# EAGLE schematic lin.reg.schematic (EAGLE 8.3.2)
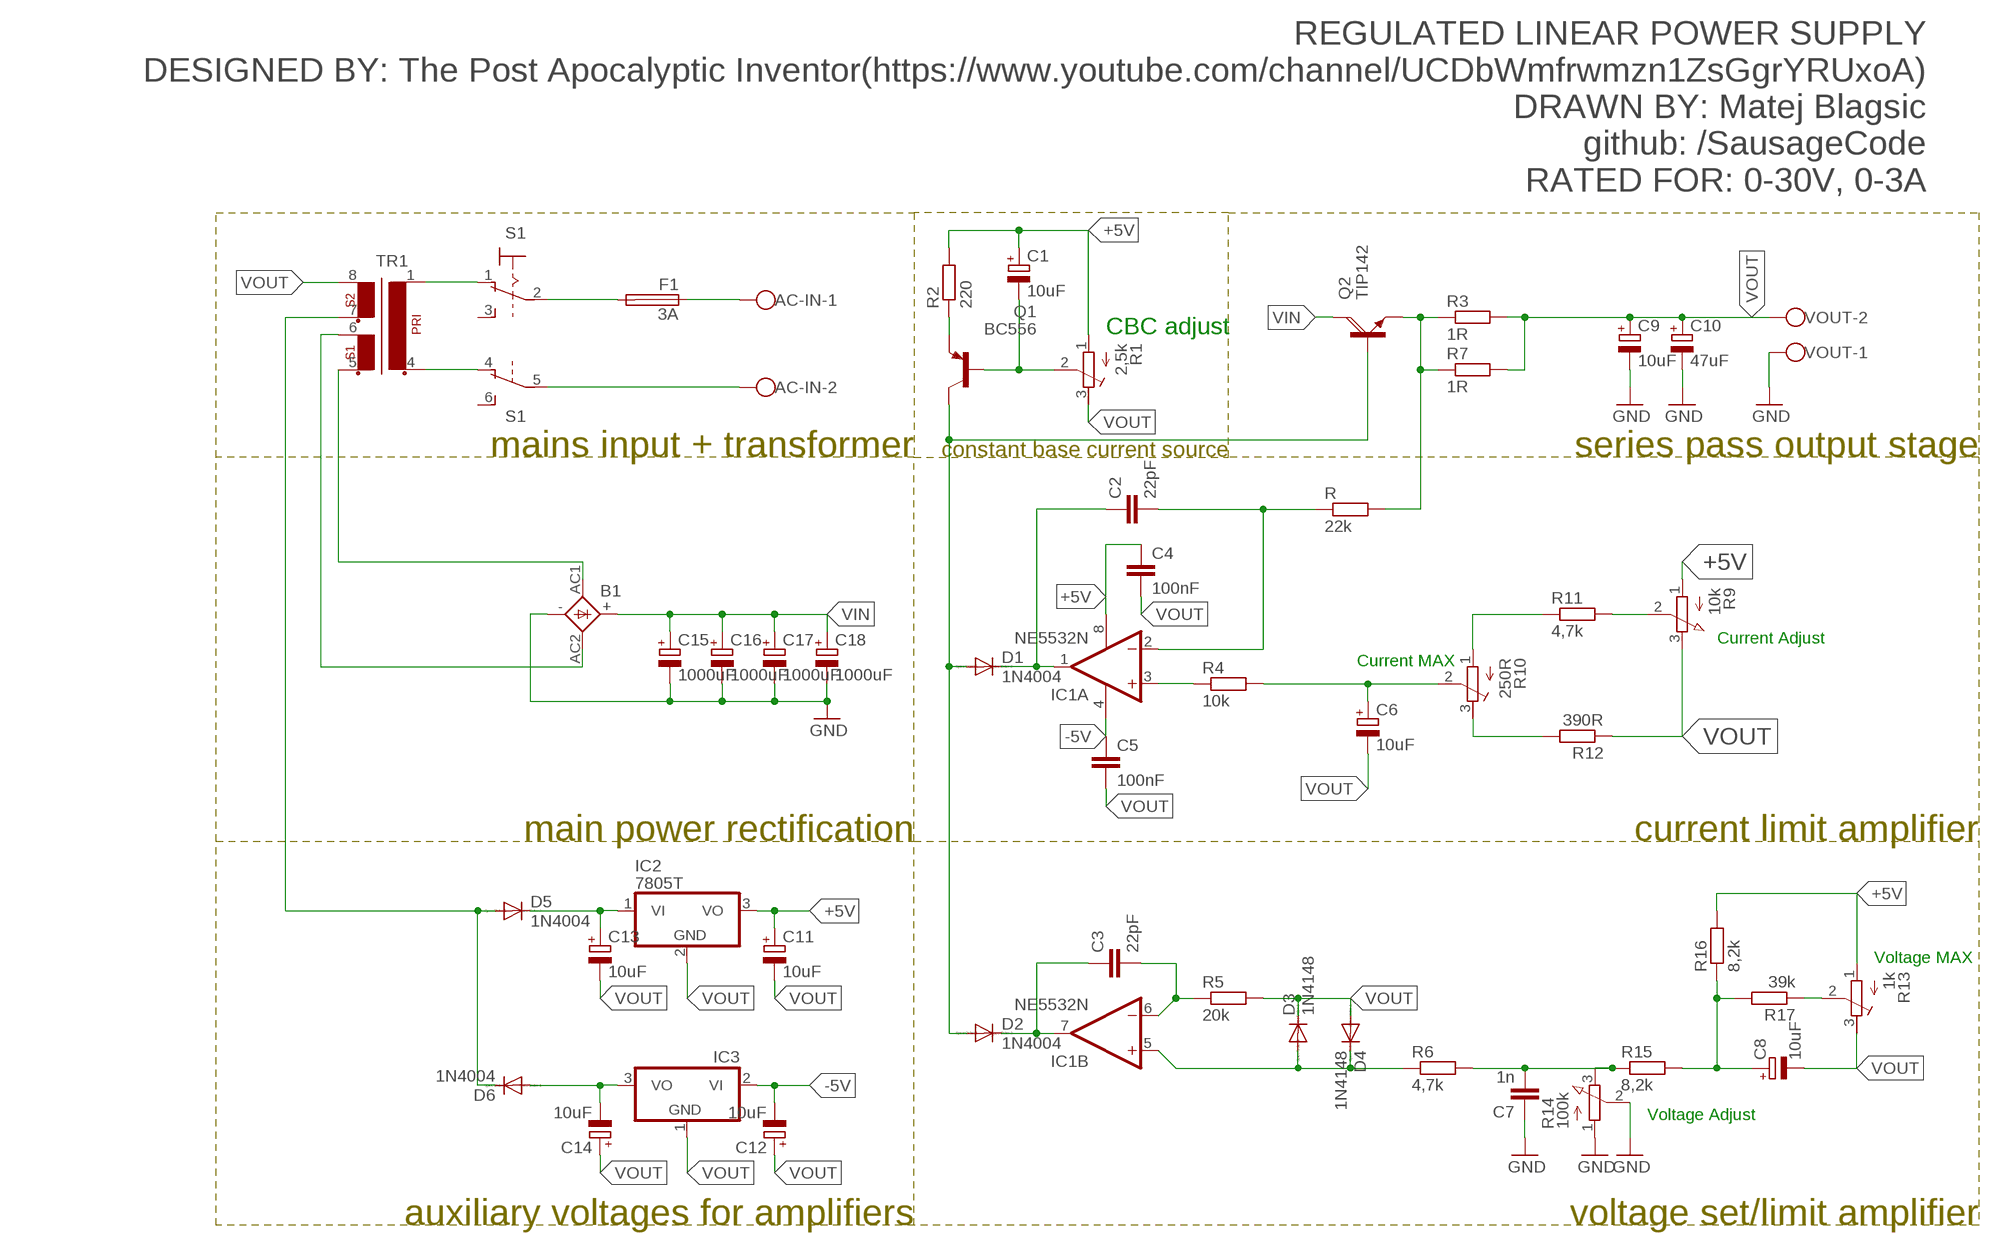
[diagram p0: schematic, sheet 1]

## Parts
AC-IN  W237-102  [W237-102]
B1  2KBB-R  [2KBB-R]
C1  10uF  CPOL-EUE2-5  [E2-5]
C2  22pF  C-EU025-025X050  [C025-025X050]
C3  22pF  C-EU025-025X050  [C025-025X050]
C4  100nF  C-EU025-025X050  [C025-025X050]
C5  100nF  C-EU025-025X050  [C025-025X050]
C6  10uF  CPOL-EUE2-5  [E2-5]
C7  1n  C-EU025-025X050  [C025-025X050]
C8  10uF  CPOL-EUE2-5  [E2-5]
C9  10uF  CPOL-EUE2-5  [E2-5]
C10  47uF  CPOL-EUE2-5  [E2-5]
C11  10uF  CPOL-EUE2-5  [E2-5]
C12  10uF  CPOL-EUE2-5  [E2-5]
C13  10uF  CPOL-EUE2-5  [E2-5]
C14  10uF  CPOL-EUE2-5  [E2-5]
C15  1000uF  CPOL-EUE2-5  [E2-5]
C16  1000uF  CPOL-EUE2-5  [E2-5]
C17  1000uF  CPOL-EUE2-5  [E2-5]
C18  1000uF  CPOL-EUE2-5  [E2-5]
D1  1N4004  [DO41-10]
D2  1N4004  [DO41-10]
D3  1N4148  1N4004  [DO41-10]
D4  1N4148  1N4004  [DO41-10]
D5  1N4004  [DO41-10]
D6  1N4004  [DO41-10]
F1  3A  FUSEGSH15  [GSH15]
IC1  NE5532N  [DIL08]
IC2  7805T  [TO220H]
IC3  7905T  [TO220H]
Q1  BC556  [TO92-EBC]
Q2  TIP142  [SOT93]
R  22k  R-EU_0207/10  [0207/10]
R1  2,5k  R-TRIMM64W  [RTRIM64W]
R2  220  R-EU_0207/10  [0207/10]
R3  1R  R-EU_0207/10  [0207/10]
R4  10k  R-EU_0207/10  [0207/10]
R5  20k  R-EU_0207/10  [0207/10]
R6  4,7k  R-EU_0207/10  [0207/10]
R7  1R  R-EU_0207/10  [0207/10]
R9  10k  3RP/1610N  [3RP/1610N]
R10  250R  R-TRIMM64W  [RTRIM64W]
R11  4,7k  R-EU_0207/10  [0207/10]
R12  390R  R-EU_0207/10  [0207/10]
R13  1k  R-TRIMM64W  [RTRIM64W]
R14  100k  3RP/1610N  [3RP/1610N]
R15  8,2k  R-EU_0207/10  [0207/10]
R16  8,2k  R-EU_0207/10  [0207/10]
R17  39k  R-EU_0207/10  [0207/10]
S1  320-938  [320-938]
TR1  EE20-2  [EE20-2]
VOUT  W237-102  [W237-102]

## Nets
+5V: C1.+ C4.1 C11.+ IC1.8(P:V+) IC2.3(VO) R1.1(A) R2.2 R9.1(A) R13.1(A) R16.2
-5V: C5.1 C12.- IC1.4(P:V-) IC3.2(VI)
GND: B1.- C7.1 C9.- C10.- C15.- C16.- C17.- C18.- R14.1(A) R14.2(S) VOUT.1
N$1: C1.- Q1.B R1.2(S)
N$2: Q1.E R2.1
N$3: R10.1(A) R11.1
N$4: C2.1 D1.C IC1.1(A:OUT)
N$5: C3.1 D2.C IC1.7(B:OUT)
N$6: D1.A D2.A Q1.C Q2.B
N$8: C3.2 IC1.6(B:-IN) R5.1
N$9: IC1.3(A:+IN) R4.1
N$10: D3.A D4.C IC1.5(B:+IN) R6.1
N$11: R10.3(E) R12.2
N$12: Q2.E R3.1 R7.1 R.2
N$13: R9.2(S) R11.2
N$14: F1.2 S1.2(1:P)
N$16: C6.+ R4.2 R10.2(S)
N$17: C2.2 IC1.2(A:-IN) R.1
N$18: C13.+ D5.C IC2.1(VI)
N$19: C7.2 R6.2 R14.3(E) R15.1
N$20: C8.+ R15.2 R16.1 R17.2
N$21: C14.- D6.A IC3.3(VO)
N$22: R13.2(S) R17.1
N$23: D5.A D6.C TR1.7
N$24: B1.AC2 TR1.6
N$25: S1.1(1:O) TR1.1
N$26: S1.4(B:O) TR1.4
N$27: AC-IN.1 F1.1
N$28: AC-IN.2 S1.5(B:P)
N$29: B1.AC1 TR1.5
VIN: B1.+ C15.+ C16.+ C17.+ C18.+ Q2.C
VOUT: C4.2 C5.2 C6.- C8.- C9.+ C10.+ C11.- C12.+ C13.- C14.+ D3.C D4.A IC2.2(GND) IC3.1(GND) R1.3(E) R3.2 R5.2 R7.2 R9.3(E) R12.1 R13.3(E) TR1.8 VOUT.2
Unconnected: S1.3(1:S) S1.6(B:S)

## Notes on the sheet
- REGULATED LINEAR POWER SUPPLY
  DESIGNED BY: The Post Apocalyptic Inventor(https://www.youtube.com/channel/UCDbWmfrwmzn1ZsGgrYRUxoA)
  DRAWN BY: Matej Blagsic
  github: /SausageCode
  RATED FOR: 0-30V, 0-3A
- CBC adjust
- mains input + transformer | constant base current source | series pass output stage
- Current Adjust
- Current MAX
- main power rectification | current limit amplifier
- Voltage MAX
- Voltage Adjust
- auxiliary voltages for amplifiers | voltage set/limit amplifier

## Library data of the parts
AC-IN VOUT = con-wago-500:W237-102: WAGO SCREW CLAMP; MPN: 237-102; OC_FARNELL: unknown; OC_NEWARK: 70K9898
B1 = rectifier:2KBB-R: RECTIFIER grid 3 x 5 mm
C1 C6 C8-C18 = rcl:CPOL-EU: POLARIZED CAPACITOR, European symbol
C2-C5 C7 = rcl:C-EU: CAPACITOR, European symbol
D1-D6 = diode:1N4004: DIODE general purpose rectifier, 1 A
F1 = fuse:FUSE: Fuse; OC_FARNELL: unknown; OC_NEWARK: unknown
IC1 = linear:NE5532: AUDIO AMPLIFIER
IC2 = linear:78*: Positive VOLTAGE REGULATOR Source: http://cache.national.com/ds/LM/LM78L05.pdf http://www.fairchildsemi.com/ds/LM/LM7805.pdf
IC3 = linear:79*: Negative VOLTAGE REGULATOR
Q1 = transistor-pnp:BC556*: PNP Transistror
Q2 = transistor-power:TIP142: NPN DARLINGTON TRANSISTOR
R R2-R7 R15-R17 = rcl:R-EU_: RESISTOR, European symbol
R1 R10 R13 = rcl:R-TRIMM: Trimm resistor
R9 R14 = pot:3RP/1610N: 16mm Potentiometer one level Source: http://www.alphapotentiometers.net/html/16mm_pot_2.html
R11 R12 = resistor:R-EU_: RESISTOR, European symbol
S1 = switch:320-938: TOGGLE SWITCH distributor RS Components
TR1 = trafo:EE20-2: TRANSFORMER 1 primary winding, 2 secondary windings ERA